# EAGLE design BOTTOM_BRD_v.1.0.3b (EAGLE 9.6.2)
NYU Shanghai Swarm Robotics 2020
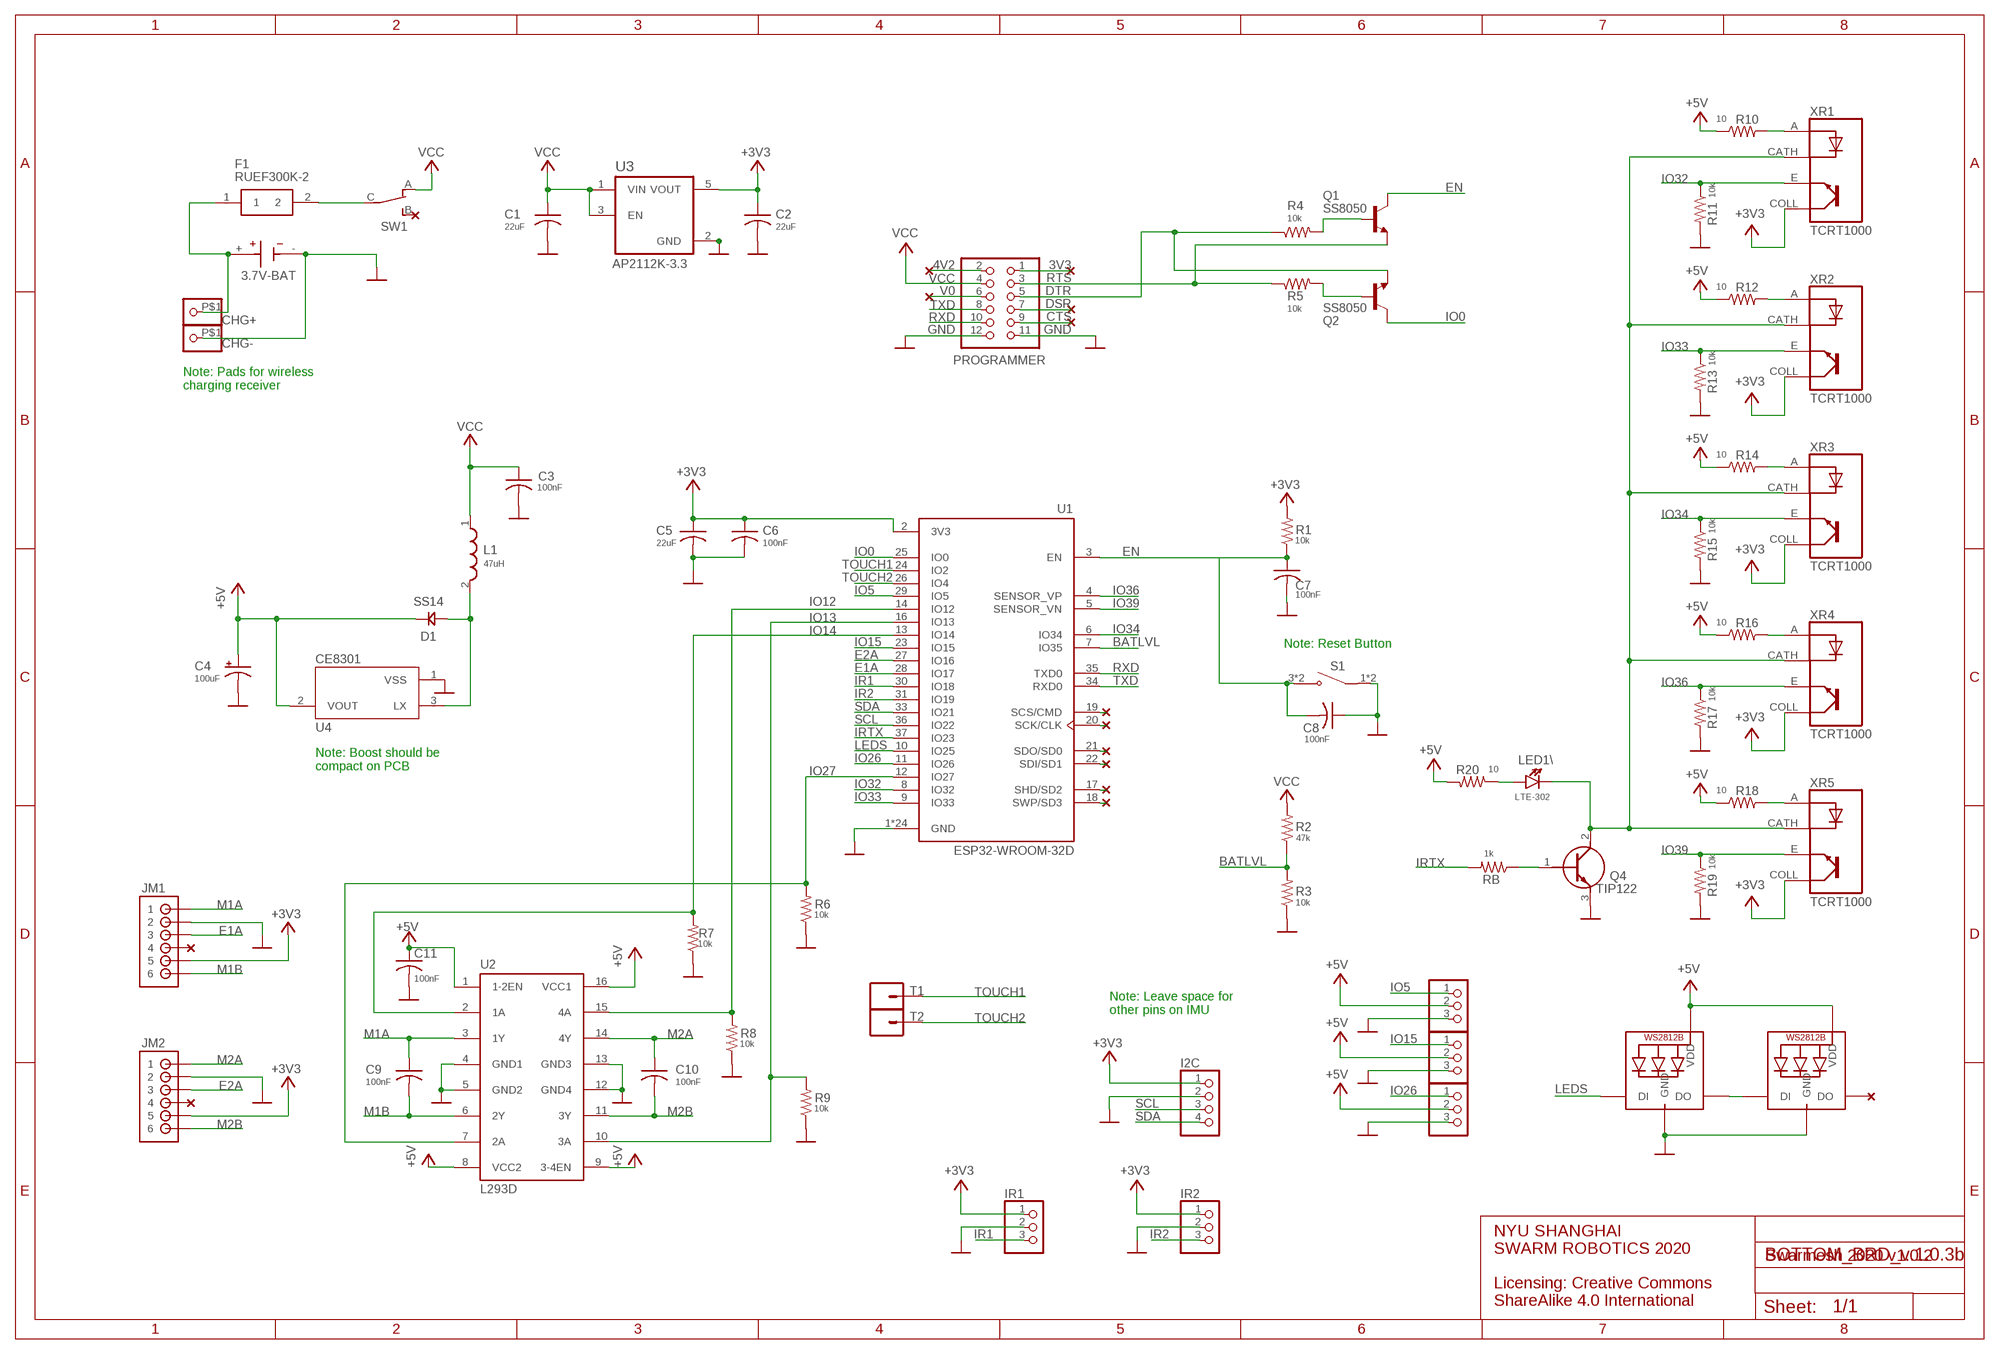
[diagram p0: schematic, sheet 1]

## Parts
BT  3.7V-BAT  6S-AA  [BAT_6S-AA]
C1  22uF  C-USC0805  [C0805]
C2  22uF  C-USC0805  [C0805]
C3  100nF  C-USC0805  [C0805]
C4  100uF  CPOL-US153CLV-0605  [153CLV-0605]
C5  22uF  C-USC0805  [C0805]
C6  100nF  C-USC0805  [C0805]
C7  100nF  C-USC0805  [C0805]
C8  100nF  C-USC0805  [C0805]
C9  100nF  C-USC0805  [C0805]
C10  100nF  C-USC0805  [C0805]
C11  100nF  C-USC0805  [C0805]
CHARGING  WS2812B5050  [WS2812B]
CHG+  PINHD-1X1-BIGPOGO  [1X1-BIGPOGO]
CHG-  PINHD-1X1-BIGPOGO  [1X1-BIGPOGO]
D1  SS14  [DO214]
F1  RUEF300K-2  [RUEF300K2]
GPIO5  PINHD-1X3  [1X03]
GPIO15  PINHD-1X3  [1X03]
GPIO26  PINHD-1X3  [1X03]
I2C  PINHD-1X4  [1X04]
IR1  PINHD-1X3  [1X03]
IR2  PINHD-1X3  [1X03]
JM1  B6B-ZR  [B6B-ZR]
JM2  B6B-ZR  [B6B-ZR]
L1  47uH  SDR0604-100KL  [INDP5858X480N]
LED1\  LTE-302  [LTE-302]
PROGRAMMER  PINHD-2X6  [2X06]
Q1  SS8050  BC850  [SOT23]
Q2  SS8050  BC850  [SOT23]
Q4  TIP122  [TO270P460X1020X2008-3P]
R1  10k  R-US_M0805  [M0805]
R2  47k  R-US_M0805  [M0805]
R3  10k  R-US_M0805  [M0805]
R4  10k  R-US_M0805  [M0805]
R5  10k  R-US_M0805  [M0805]
R6  10k  R-US_M0805  [M0805]
R7  10k  R-US_M0805  [M0805]
R8  10k  R-US_M0805  [M0805]
R9  10k  R-US_M0805  [M0805]
R10  10  R-US_M0805  [M0805]
R11  10k  R-US_M0805  [M0805]
R12  10  R-US_M0805  [M0805]
R13  10k  R-US_M0805  [M0805]
R14  10  R-US_M0805  [M0805]
R15  10k  R-US_M0805  [M0805]
R16  10  R-US_M0805  [M0805]
R17  10k  R-US_M0805  [M0805]
R18  10  R-US_M0805  [M0805]
R19  10k  R-US_M0805  [M0805]
R20  10  R-US_M0805  [M0805]
RB  1k  R-US_M0805  [M0805]
S1  2-1437565-9  [SW_2-1437565-9]
STATE  WS2812B5050  [WS2812B]
SW1  CS12ANW03  [CS12ANW03]
T1  CONN_01SPRING-CONN  [SPRING-CONNECTOR]
T2  CONN_01SPRING-CONN  [SPRING-CONNECTOR]
U1  ESP32-WROOM-32D  [MODULE_ESP32-WROOM-32D]
U2  L293D  [DIL16]
U3  AP2112K-3.3  AP2112K-3.3TRG1  [SOT95P285X140-5N]
U4  CE8301  MCP1702T-3302E/MB  [REG_MCP1702T-3302E/MB]
XR1  TCRT1000  [XDCR_TCRT1000]
XR2  TCRT1000  [XDCR_TCRT1000]
XR3  TCRT1000  [XDCR_TCRT1000]
XR4  TCRT1000  [XDCR_TCRT1000]
XR5  TCRT1000  [XDCR_TCRT1000]

## Nets
3V3: PROGRAMMER.1
4V2: PROGRAMMER.2
+3V3: C2.1 C5.1 C6.1 I2C.1 IR1.1 IR2.1 JM1.5 JM2.5 R1.2 U1.2(3V3) U3.5(VOUT) XR1.COLL(CO) XR2.COLL(CO) XR3.COLL(CO) XR4.COLL(CO) XR5.COLL(CO)
+5V: C4.+ C11.1 CHARGING.1-VDD(VDD) D1.CATHODE(KATHODE) GPIO5.2 GPIO15.2 GPIO26.2 R10.1 R12.1 R14.1 R16.1 R18.1 R20.2 STATE.1-VDD(VDD) U2.1(1-2EN) U2.8(VCC2) U2.9(3-4EN) U2.16(VCC1) U4.2(VOUT)
BATLVL: R2.1 R3.2 U1.7(IO35)
CTS: PROGRAMMER.9
DSR: PROGRAMMER.7
DTR: PROGRAMMER.5 Q2.2(E) R4.1
E1A: JM1.3 U1.28(IO17)
E2A: JM2.3 U1.27(IO16)
EN: C7.1 C8.2 Q1.3(C) R1.1 S1.3(NO) S1.4(NO) U1.3(EN)
GND: BT.- C1.2 C2.2 C3.2 C4.- C5.2 C6.2 C7.2 C8.1 C11.2 CHARGING.3-GND(GND) CHG-.P$1 GPIO5.3 GPIO15.3 GPIO26.3 I2C.2 IR1.2 IR2.2 JM1.2 JM2.2 PROGRAMMER.11 PROGRAMMER.12 Q4.3(E) R3.1 R6.1 R7.1 R8.1 R9.1 R11.2 R13.2 R15.2 R17.2 R19.2 S1.1(COM) S1.2(COM) STATE.3-GND(GND) U1.1(GND) U1.15(GND) U1.38(GND) U1.39_1(GND) U1.39_2(GND) U1.39_3(GND) U1.39_4(GND) U1.39_5(GND) U1.39_6(GND) U1.39_7(GND) U1.39_8(GND) U1.39_9(GND) U1.39_10(GND) U1.39_11(GND) U1.39_12(GND) U1.39_13(GND) U1.39_14(GND) U1.39_15(GND) U1.39_16(GND) U1.39_17(GND) U1.39_18(GND) U1.39_19(GND) U1.39_20(GND) U1.39_21(GND) U2.4(GND1) U2.5(GND2) U2.12(GND4) U2.13(GND3) U3.2(GND) U4.1(VSS)
IO0: Q2.3(C) U1.25(IO0)
IO5: GPIO5.1 U1.29(IO5)
IO12: R8.2 U1.14(IO12) U2.15(4A)
IO13: R9.2 U1.16(IO13) U2.10(3A)
IO14: R7.2 U1.13(IO14) U2.2(1A)
IO15: GPIO15.1 U1.23(IO15)
IO26: GPIO26.1 U1.11(IO26)
IO27: R6.2 U1.12(IO27) U2.7(2A)
IO32: R11.1 U1.8(IO32) XR1.E
IO33: R13.1 U1.9(IO33) XR2.E
IO34: R15.1 U1.6(IO34) XR3.E
IO36: R17.1 U1.4(SENSOR_VP) XR4.E
IO39: R19.1 U1.5(SENSOR_VN) XR5.E
IR1: IR1.3 U1.30(IO18)
IR2: IR2.3 U1.31(IO19)
IRTX: RB.2 U1.37(IO23)
LEDS: CHARGING.4-DIN(DI) U1.10(IO25)
M1A: C9.1 JM1.1 U2.3(1Y)
M1B: C9.2 JM1.6 U2.6(2Y)
M2A: C10.1 JM2.1 U2.14(4Y)
M2B: C10.2 JM2.6 U2.11(3Y)
N$1: BT.+ CHG+.P$1 F1.1
N$2: Q4.1(B) RB.1
N$3: F1.2 SW1.C
N$4: D1.ANODE L1.2 U4.3(LX)
N$5: U1.19(SCS/CMD)
N$6: R12.2 XR2.A
N$7: R16.2 XR4.A
N$8: LED1\.C Q4.2(C) XR1.CATH(C) XR2.CATH(C) XR3.CATH(C) XR4.CATH(C) XR5.CATH(C)
N$9: CHARGING.2-DOUT(DO) STATE.4-DIN(DI)
N$10: R14.2 XR3.A
N$11: R18.2 XR5.A
N$12: Q1.1(B) R4.2
N$13: R10.2 XR1.A
N$14: LED1\.A R20.1
N$15: Q2.1(B) R5.2
N$16: U1.20(SCK/CLK)
N$18: U1.21(SDO/SD0)
N$23: U1.22(SDI/SD1)
N$24: U1.17(SHD/SD2)
N$25: U1.18(SWP/SD3)
RTS: PROGRAMMER.3 Q1.2(E) R5.1
RXD: PROGRAMMER.10 U1.35(TXD0)
SCL: I2C.3 U1.36(IO22)
SDA: I2C.4 U1.33(IO21)
TOUCH1: T1.P$2 U1.24(IO2)
TOUCH2: T2.P$2 U1.26(IO4)
TXD: PROGRAMMER.8 U1.34(RXD0)
V0: PROGRAMMER.6
VCC: C1.1 C3.1 L1.1 PROGRAMMER.4 R2.2 SW1.A U3.1(VIN) U3.3(EN)
Unconnected: JM1.4 JM2.4 STATE.2-DOUT(DO) SW1.B

## Notes on the sheet
- Note: Pads for wireless 
  charging receiver
- Note: Reset Button
- Note: Boost should be
  compact on PCB
- Note: Leave space for 
  other pins on IMU
- Swarmesh 2020 v1.0.2
- NYU SHANGHAI
  SWARM ROBOTICS 2020
  
  Licensing: Creative Commons
  ShareAlike 4.0 International

## Library data of the parts
BT = 6S-AA:6S-AA; AVAILABILITY: Unavailable; DESCRIPTION: BATTERY HOLDER AA PC PIN; DIGIKEY-PURCHASE-URL: https://snapeda.com/shop?store=DigiKey&id=4389101; MF: MPD; MP: 6S-AA; PACKAGE: None; PRICE: None
C1-C3 C5-C11 = rcl:C-US: CAPACITOR, American symbol; SPICEPREFIX: C
C4 = rcl:CPOL-US: POLARIZED CAPACITOR, American symbol; SPICEPREFIX: C
CHARGING STATE = adafruit:WS2812B
CHG+ CHG- = adafruit:PINHD-1X1: Pin header 1x1 for 0.1" spacing With round pins
D1 = SS14:SS14; AVAILABILITY: Unavailable; DESCRIPTION: Diode Schottky 40V 1A Surface Mount SMA (DO-214AC); DIGIKEY-PURCHASE-URL: https://snapeda.com/shop?store=DigiKey&id=229686; MF: ON Semiconductor; MP: SS14; PACKAGE: DO-214AC-214 ON Semiconductor; PRICE: None
F1 = RUEF300K-2:RUEF300K-2: TE CONNECTIVITY / RAYCHEM - RUEF300K-2 - RESETTABLE FUSE, PTC, 30V, 3A, RADIAL Source: Datasheet <http://www.farnell.com/datasheets/1482689.pdf>; DESCRIPTION: TE CONNECTIVITY / RAYCHEM - RUEF300K-2 - RESETTABLE FUSE, PTC, 30V, 3A, RADIAL; HEIGHT: 16.5mm; MANUFACTURER_NAME: TE CONNECTIVITY / RAYCHEM; MANUFACTURER_PART_NUMBER: RUEF300K-2
GPIO5 GPIO15 GPIO26 IR1 IR2 = adafruit:PINHD-1X3: PIN HEADER
I2C = pinhead:PINHD-1X4: PIN HEADER
JM1 JM2 = B6B-ZR:B6B-ZR: JST-ZH Connector 6 pol, 1.5mm pitch Package: B6B-ZR Source: http://www.jst-mfg.com/product/pdf/eng/eZH.pdf; AVAILABILITY: Unavailable; DESCRIPTION: Connector Header Surface Mount 6 position 0.059 _1.50mm_; MF: JST; MP: B6B-ZR; PACKAGE: None; PRICE: None
L1 = SDR0604-100KL:SDR0604-100KL: Inductor Power Wirewound 120uH 10% 1KHz 22Q-Factor Ferrite 480mA 930mOhm DCR T/R; AVAILABILITY: Unavailable; DESCRIPTION: 10µH Unshielded Wirewound Inductor Nonstandard; MF: Bourns; MP: SDR0604-100KL; PACKAGE: Nonstandard Bourns; PRICE: None
LED1\ = LTE-302:LTE-302: Through-hole side-firing 940nm IR LED; DESCRIPTION: Infrared (IR) Emitter 940nm 1.2V 50mA 0.662mW/sr @ 20mA 40° Radial, Side View; DIGI-KEY_PART_NUMBER: 160-1930-ND; MF: Lite-On Inc.; MP: LTE-302; PACKAGE: Radial Lite-On
PROGRAMMER = pinhead:PINHD-2X6: PIN HEADER
Q1 Q2 = transistor:BC850: NPN TRANSISTOR
Q4 = TIP122:TIP122: TIP122, Darlington Transistor, NPN 8 A 100 V HFE:1000, 3-Pin, TO-220 Source: Datasheet <https://componentsearchengine.com/Datasheets/1/TIP122.pdf>; DESCRIPTION: TIP122, Darlington Transistor, NPN 8 A 100 V HFE:1000, 3-Pin, TO-220; HEIGHT: 4.6mm; MANUFACTURER_NAME: STMicroelectronics; MANUFACTURER_PART_NUMBER: TIP122; MOUSER_PART_NUMBER: 511-TIP122; MOUSER_PRICE-STOCK: https://www.mouser.com/Search/Refine.aspx?Keyword=511-TIP122
R1-R20 RB = rcl:R-US_: RESISTOR, American symbol; SPICEPREFIX: R
S1 = pushswitch:2-1437565-9; AVAILABILITY: Unavailable; COMMENT: 2-1437565-9; DESCRIPTION: Tactile Switch SPST-NO Top Actuated Surface Mount; MF: TE Connectivity; MP: 2-1437565-9; PACKAGE: SMD-6 Omron Electronics; PRICE: None
SW1 = SWITCH_C:CS12ANW03; AVAILABILITY: Unavailable; DESCRIPTION: Slide Switch SPDT Through Hole; DIGIKEY-PURCHASE-URL: https://snapeda.com/shop?store=DigiKey&id=478299; MF: NKK Switches; MP: CS12ANW03; PACKAGE: None; PRICE: None
T1 T2 = Touch_Pad:CONN_01: Single connection point. Often used as Generic Header-pin footprint for 0.1 inch spaced/style header connections On any of the 0.1 inch spaced packages, you can populate with these: Break Away Headers - Straight <https://www.sparkfun.com/products/116> (PRT-00116) Break Away Male Headers - Right Angle <https://www.sparkfun.com/products/553> (PRT-00553) Female Headers <https://www.sparkfun.com/products/115> (PRT-00115) Break Away Headers - Machine Pin <https://www.sparkfun.com/products/117> (PRT-00117) Break Away Female Headers - Swiss Machine Pin <https://www.sparkfun.com/products/743> (PRT-00743) This device is also useful as a general connection point to wire up your design to another part of your project. Our various solder wires solder well into these plated through hole pads. Hook-Up Wire - Assortment (Stranded, 22 AWG) <https://www.sparkfun.com/products/11375> (PRT-11375) Hook-Up Wire - Assortment (Solid Core, 22 AWG) <https://www.sparkfun.com/products/11367> (PRT-11367) View the entire wire category on our website here <https://www.sparkfun.com/categories/141> Special notes: SMTSO-256-ET is a "flush mount" nut for a 4-40 screw. We mostly use this on specialty testbeds; it is a nice way to connect hardware to your PCB at an adjustable hieght. Also note, the SNAP packages are for using a snappable style connector. We sell a baggie of snaps and they are also used on two LilyPad designs: Snap Assortment - 30 pack (male and female) <https://www.sparkfun.com/products/11347> (DEV-11347) LilyPad Arduino SimpleSnap <https://www.sparkfun.com/products/10941> (DEV-10941) LilyPad SimpleSnap Protoboard <https://www.sparkfun.com/products/10940> (DEV-10940); SF_ID: PRT-11822
U1 = ESP32-WROOM-32D:ESP32-WROOM-32D: Bluetooth, WiFi 802.11b/g/n, Bluetooth v4.2 + EDR, Class 1, 2 and 3 Transceiver Module 2.4GHz ~ 2.5GHz Integrated, Trace Surface Mount; AVAILABILITY: Unavailable; DESCRIPTION: Bluetooth, WiFi 802.11b/g/n, Bluetooth v4.2 +EDR, Class 1, 2 and 3 Transceiver Module 2.4GHz ~ 2.5GHz Integrated, Trace Surface Mount; MF: Espressif Systems; MP: ESP32-WROOM-32D; PACKAGE: Module Espressif Systems; PRICE: None
U2 = st-microelectronics:L293D: PUSH-PULL 4 CHANNEL DRIVER; MPN: L293D; OC_FARNELL: 9589619; OC_NEWARK: 56P8249
U3 = AP2112K-3.3TRG1:AP2112K-3.3TRG1: AP2112 Series 0.6 A 3.3 V Fixed Output SMT LDO Linear Regulator - SOT23-5; AVAILABILITY: Unavailable; DESCRIPTION: Linear Voltage Regulator IC 1 Output 600mA SOT-25; MF: Diodes Inc.; MP: AP2112K-3.3TRG1; PACKAGE: SOT-753 Diodes Inc.; PRICE: None
U4 = MCP1702T-3302E_MB:MCP1702T-3302E/MB: MCP1702 Series 250 mA 3.3 V Fixed Output Surface Mount LDO Regulator - SOT-89; AVAILABILITY: Unavailable; DESCRIPTION: Linear Voltage Regulator IC 1 Output 250mA SOT-89-3; MF: Microchip; MP: MCP1702T-3302E/MB; PACKAGE: SOT-89 Microchip; PRICE: None
XR1-XR5 = ST188:TCRT1000: Optical Sensor The TCRT1000 and TCRT1010 are reflective sensors which include an infrared emitter and phototransistor in a leaded package which blocks visible light; AVAILABILITY: Unavailable; DESCRIPTION: Reflective Optical Sensor 0.157 (4mm) PCB Mount; MF: Vishay; MP: TCRT1000; PACKAGE: PCB Mount Vishay; PRICE: None

## Board
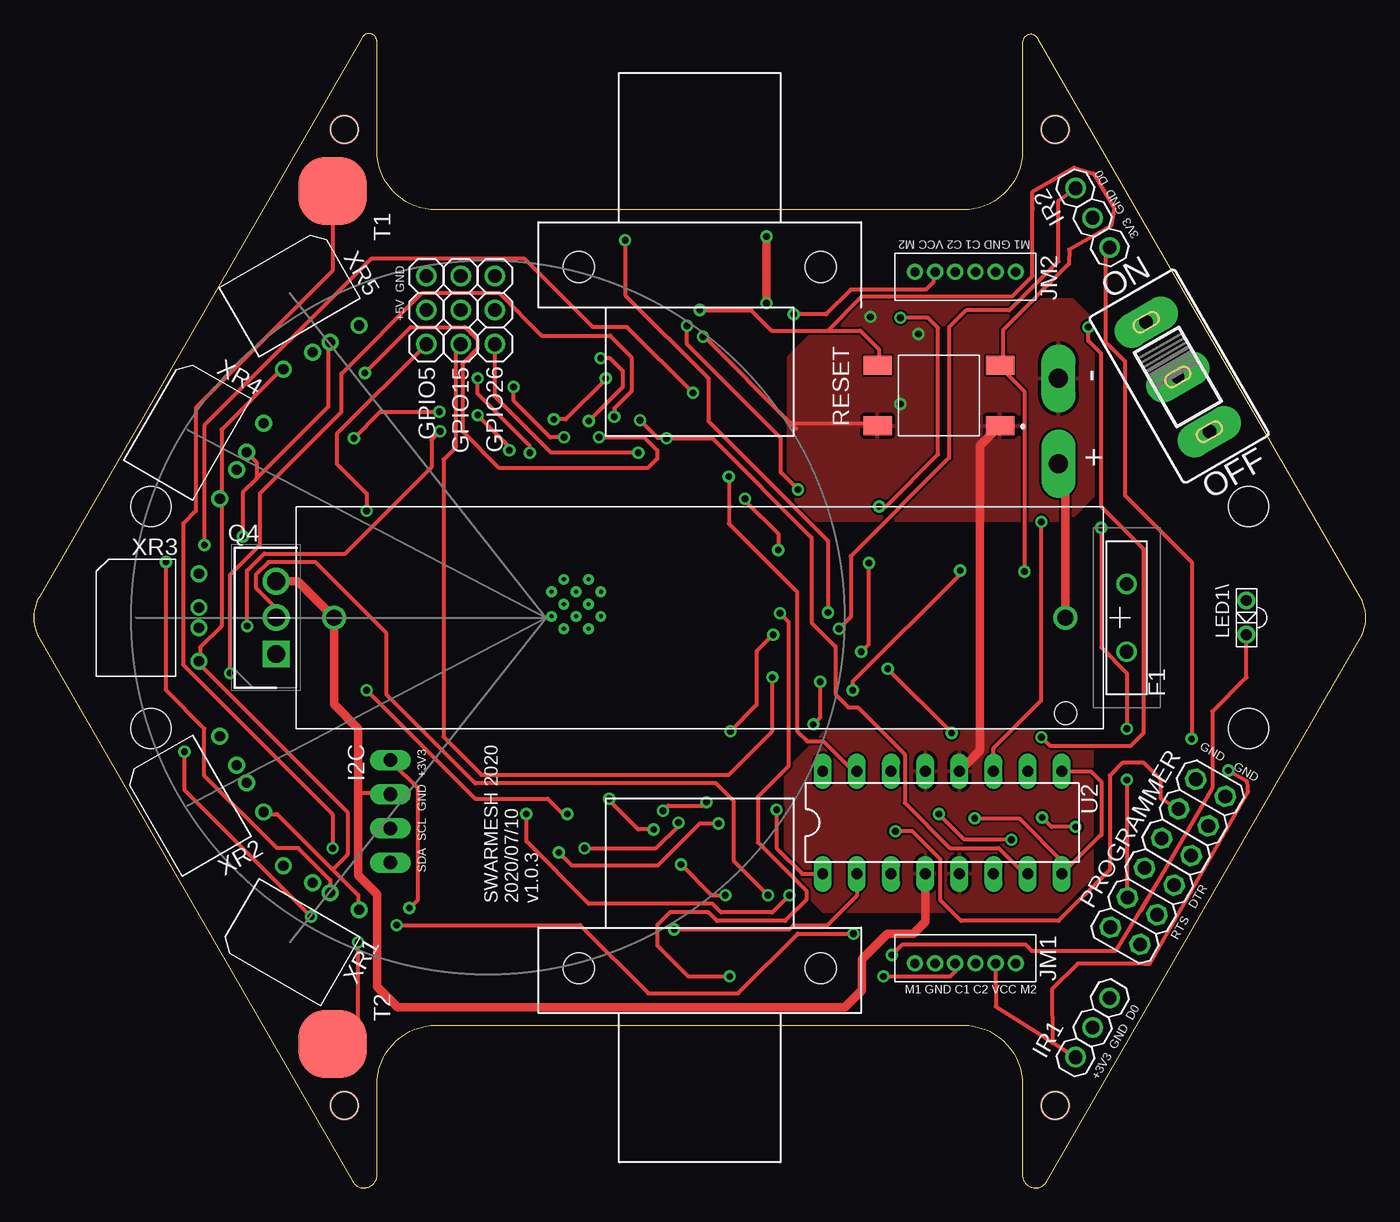
[diagram p1: board, top side]
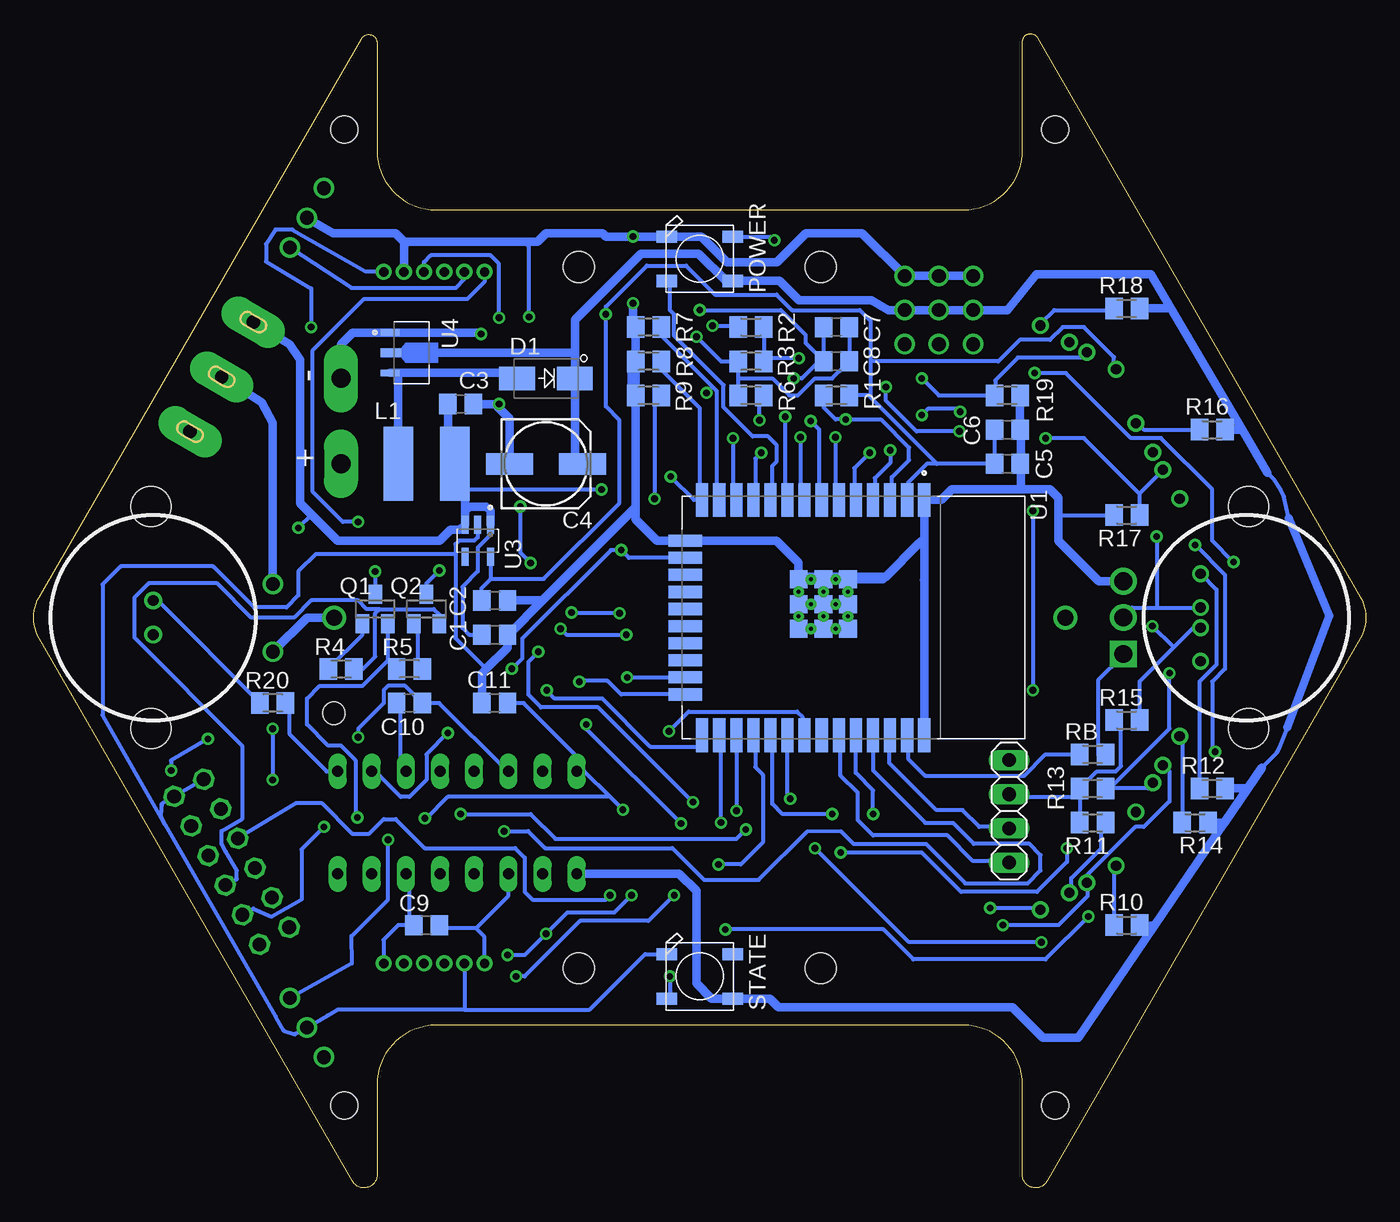
[diagram p2: board, bottom side, seen from below]

Size 99.06 x 85.8 mm. Coordinates in mm from the lower left corner, seen from the top.
Outline: 75.33,0.48 98.65,40.87 arc60 98.65,43.91 74.68,85.43 arc150 73.53,85.12 73.53,77.1 arc-90 69.12,72.69 29.94,72.69 arc-90 25.53,77.1 25.53,85.2 arc150 24.42,85.5 0.41,43.91 arc60 0.41,40.87 23.73,0.48 arc150 25.53,0.97 25.53,7.68 arc-90 29.94,12.09 69.12,12.09 arc-90 73.53,7.68 73.53,0.97 arc150 75.33,0.48
Copper layers (1*16): Top 0.035mm / dielectric 0.15mm / Bottom 0.035mm
Design rules "default *": minimum track width 12mil, minimum drill 0.5mm, track to track 6mil, track to pad 6mil, pad to pad 6mil, via to via 20mil, smd to smd 6mil, copper to edge 40mil, drill to drill 25mil, minimum pad ring 10mil, minimum via ring 8mil, stop-mask expansion 4mil, vias tented up to drill 0mil, thermal gap 10mil
Holes 2 mm at 75.96,78.66 23.11,78.66 23.11,6.12 75.96,6.12
Holes 3 mm at 8.73,50.64 8.73,34.14 90.33,50.64 90.33,34.14
Holes 2.3 mm at 58.53,16.33 40.53,16.33 40.53,68.45 58.53,68.45
tKeepout: area 74.3,77 to 77.6,80.3; area 21.5,77 to 24.7,80.3; area 21.5,4.5 to 24.7,7.7; area 74.3,4.5 to 77.6,7.7
tRestrict: area 30.8,33.4 to 49.8,51.3

### Footprints (pad centres in the part's own frame; a part is rotated, then mirrored left to right if it is on the bottom)
BAT_6S-AA = drill 1.19: + -27.2,0; - 27.2,0 | hole 1.67: -27.2,7.1
C0805 = smd 1.3 x 1.5: 1 -0.95,0; 2 0.95,0
153CLV-0605 = smd 3.5 x 1.6: + 2.7,0; - -2.7,0
WS2812B = smd 1.5 x 0.9: 1-VDD 2.45,-1.65; 2-DOUT 2.45,1.65; 3-GND -2.45,1.65; 4-DIN -2.45,-1.65
1X1-BIGPOGO = drill 1.4 pad 2.54 long: P$1 0,0
DO214 = smd 2.65 x 1.75: ANODE -2.15,0; CATHODE 2.15,0
RUEF300K2 = drill 1.01 pad 1.515: 1 0,0; 2 5.05,0
1X03 = drill 1.016: 1 -2.54,0; 2 0,0; 3 2.54,0
1X04 = drill 1.016 long: 1 -3.81,0; 2 -1.27,0; 3 1.27,0; 4 3.81,0
B6B-ZR = drill 0.7: 1 9,-1.3; 2 7.5,-1.3; 3 6,-1.3; 4 4.5,-1.3; 5 3,-1.3; 6 1.5,-1.3
INDP5858X480N = smd 2.2 x 5.5: 1 -2.1,0; 2 2.1,0
LTE-302 = drill 0.8: A 1.27,0; C -1.27,0
2X06 = drill 1.016 octagon: 1 -6.35,-1.27; 2 -6.35,1.27; 3 -3.81,-1.27; 4 -3.81,1.27; 5 -1.27,-1.27; 6 -1.27,1.27; 7 1.27,-1.27; 8 1.27,1.27; 9 3.81,-1.27; 10 3.81,1.27; 11 6.35,-1.27; 12 6.35,1.27
SOT23 = smd 1 x 1.4: 1 -0.95,-1.1; 2 0.95,-1.1; 3 0,1.1
TO270P460X1020X2008-3P = drill 1.32 pad 1.98 square: 1 0,0 | drill 1.32 pad 1.98: 2 2.7,0; 3 5.4,0
M0805 = smd 1.3 x 1.6: 1 -0.95,0; 2 0.95,0
SW_2-1437565-9 = smd 2.1 x 1.4: 1 -4.55,2.25; 2 4.55,2.25; 3 -4.55,-2.25; 4 4.55,-2.25
CS12ANW03 = drill 1 pad 2.54 long: A -4.674,0; B 4.724,0; C 0.025,0
SPRING-CONNECTOR = smd 5.08 x 5.08: P$2 0,0
MODULE_ESP32-WROOM-32D = smd 2.5 x 0.9: 1 -8.75,5.26; 2 -8.75,3.99; 3 -8.75,2.72; 4 -8.75,1.45; 5 -8.75,0.18; 6 -8.75,-1.09; 7 -8.75,-2.36; 8 -8.75,-3.63; 9 -8.75,-4.9; 10 -8.75,-6.17; 11 -8.75,-7.44; 12 -8.75,-8.71; 13 -8.75,-9.98; 14 -8.75,-11.25; 25 8.75,-11.25; 26 8.75,-9.98; 27 8.75,-8.71; 28 8.75,-7.44; 29 8.75,-6.17; 30 8.75,-4.9; 31 8.75,-3.63; 32 8.75,-2.36; 33 8.75,-1.09; 34 8.75,0.18; 35 8.75,1.45; 36 8.75,2.72; 37 8.75,3.99; 38 8.75,5.26 | smd 0.9 x 2.5: 15 -5.715,-12.5; 16 -4.445,-12.5; 17 -3.175,-12.5; 18 -1.905,-12.5; 19 -0.635,-12.5; 20 0.635,-12.5; 21 1.905,-12.5; 22 3.175,-12.5; 23 4.445,-12.5; 24 5.715,-12.5 | smd 1.33 x 1.33: 39_1 -2.835,-0.405; 39_2 -1,-0.405; 39_3 0.835,-0.405; 39_4 -2.835,-2.24; 39_5 -1,-2.24; 39_6 0.835,-2.24; 39_7 -2.835,-4.075; 39_8 -1,-4.075; 39_9 0.835,-4.075 | drill 0.3 pad 0.4: 39_10 -1.917,-0.405; 39_11 -0.083,-0.405; 39_12 -2.835,-1.323; 39_13 -1,-1.323; 39_14 0.835,-1.323; 39_15 -1.917,-2.24; 39_16 -0.083,-2.24; 39_17 -2.835,-3.158; 39_18 -1,-3.158; 39_19 0.835,-3.158; 39_20 -1.917,-4.075; 39_21 -0.083,-4.075
DIL16 = drill 0.813 long: 1 -8.89,-3.81; 2 -6.35,-3.81; 3 -3.81,-3.81; 4 -1.27,-3.81; 5 1.27,-3.81; 6 3.81,-3.81; 7 6.35,-3.81; 8 8.89,-3.81; 9 8.89,3.81; 10 6.35,3.81; 11 3.81,3.81; 12 1.27,3.81; 13 -1.27,3.81; 14 -3.81,3.81; 15 -6.35,3.81; 16 -8.89,3.81
SOT95P285X140-5N = smd 1.35 x 0.6: 1 -1.185,0.95; 2 -1.185,0; 3 -1.185,-0.95; 4 1.185,-0.95; 5 1.185,0.95
REG_MCP1702T-3302E/MB = smd 1.4 x 0.48: 1 -1.425,1.5; 3 -1.425,-1.5 | smd 1.525 x 0.56: 2 -1.365,0
XDCR_TCRT1000 = drill 0.75 pad 1.1: A -3.25,4.67; CATH -0.75,4.67; COLL 3.25,4.67; E 0.75,4.67

### Placement (x,y rotation side)
BT  49.53,42.39 180 top
C1  64.77,41.12 0 bottom
C2  64.77,43.66 0 bottom
C3  67.31,58.27 0 bottom
C4  60.96,53.82 0 bottom
C5  26.67,53.82 0 bottom
C6  26.67,56.36 0 bottom
C7  39.37,63.98 0 bottom
C8  39.37,61.44 180 bottom
C9  69.85,19.53 180 bottom
C10  71.12,36.04 180 bottom
C11  64.77,36.04 180 bottom
CHARGING  49.53,69.06 0 bottom
CHG+  76.2,53.82 270 bottom
CHG-  76.2,60.17 90 top
D1  60.96,60.17 0 bottom
F1  81.28,39.85 90 top
GPIO5  29.21,65.25 90 top
GPIO15  31.75,65.25 90 top
GPIO26  34.29,65.25 90 top
I2C  26.53,27.99 270 bottom
IR1  78.74,11.91 60 top
IR2  78.74,72.11 120 top
JM1  74.53,15.39 180 top
JM2  64.03,69.39 0 top
L1  69.85,53.82 180 bottom
LED1\  90.17,42.39 90 top
PROGRAMMER  84.34,24.24 60 top
Q1  73.66,43.03 0 bottom
Q2  69.85,43.03 0 bottom
Q4  18.03,39.69 90 top
R1  39.37,58.9 0 bottom
R2  45.72,63.98 180 bottom
R3  45.72,61.44 0 bottom
R4  76.2,38.58 180 bottom
R5  71.12,38.58 0 bottom
R6  45.72,58.9 0 bottom
R7  53.34,63.98 0 bottom
R8  53.34,61.44 0 bottom
R9  53.34,58.9 0 bottom
R10  17.78,19.53 180 bottom
R11  20.32,27.15 180 bottom
R12  12.7,27.15 180 bottom
R13  20.32,29.69 180 bottom
R14  11.43,29.69 180 bottom
R15  17.78,34.77 180 bottom
R16  11.43,56.36 180 bottom
R17  17.78,50.01 180 bottom
R18  17.78,65.38 180 bottom
R19  26.67,58.9 0 bottom
R20  81.28,36.04 0 bottom
RB  20.32,32.23 180 bottom
S1  67.31,58.9 180 top
STATE  49.53,15.72 0 bottom
SW1  85.06,60.3 300 top
T1  22.23,74.09 0 top
T2  22.23,10.69 0 top
U1  38.1,42.39 270 bottom
U2  67.56,27.15 0 top
U3  66.04,48.11 270 bottom
U4  71.12,62.08 0 bottom
XR1  19.05,18.26 330 top
XR2  11.43,28.42 300 top
XR3  7.62,42.39 270 top
XR4  11.43,56.36 240 top
XR5  19.05,66.52 210 top

### Tracks (layer width: path | path; a pad name or v marks a point on that pad's centre or on a via)
+3V3  (via drill 0.5)
  Top 0.305: 22.22,23.66 18.1,27.79 17.14,27.79 XR2.COLL | 22.22,23.66 24.13,21.75 24.13,20.8 XR1.COLL | v27.94,20.8 28.57,21.44 28.57,29.69 26.67,31.6 I2C.1 | XR5.COLL 18.41,60.81 13.97,56.36 13.97,51.28 XR4.COLL 13.97,50.96 13.97,41.76 12.38,40.17 12.38,39.22 XR3.COLL 12.38,38.9 23.34,27.94 23.34,24.78 22.22,23.66 | v86.11,33.37 86.11,46.52 81.15,51.47 81.15,61.44 79.69,62.9 79.69,69.63 79.97,69.91 IR2.1 | v56.51,64.93 58.93,64.93 60.77,66.78 66.36,66.78 66.94,67.36 JM2.5 | v88.84,31.02 90.21,30.22 90.3,29.41 82.98,16.67 82.55,16.67 77.63,16.67 75.77,14.81 75.78,10.78 | 75.78,10.78 73.34,12.33 71.54,13.48 JM1.5 | 75.78,10.78 IR1.1
  Bottom 0.305: U1.2 34.04,51.22 34.04,52.42 32.64,53.82 31.9,53.82 | 36.83,61.44 36.83,64.44 37.62,65.24 42.66,65.24 43.81,66.39 48.39,66.39 50.55,68.55 53.47,68.55 56.51,65.51 v56.51,64.93 56.51,58.09 55.5,57.07 55.5,50.9 61.13,45.27 65.09,45.27 U3.5 65.09,45.25 65.79,44.55 65.79,43.73 C2.1 | 36.83,61.44 36.83,58.9 36.98,58.9 | 27.63,56.38 C6.1 C5.1 31.9,53.82 | v27.94,20.8 24.45,20.8 XR1.COLL | 36.98,58.9 R1.2 | 36.83,61.44 27.33,61.44 25.74,63.03 23.49,63.03 22.54,63.98 20.95,63.98 18.73,61.76 18.73,61.12 XR5.COLL | JM2.5 67.03,67.58 67.67,66.9 75.43,66.9 IR2.1 | 31.9,53.82 36.98,58.9 | v86.11,33.37 88.85,31.77 v88.84,31.02
+5V  (via drill 0.5)
  Top 0.305: 76.83,23.66 76.96,23.79 76.45,24.29 | U2.9 78.61,30.96 79.37,30.2 79.37,26.2 79.31,26.2 U2.8 76.45,24.29 | v55.24,28.1 55.24,25.25 57.15,23.34 U2.1 | 76.45,24.29 73.28,27.47 v69.98,27.47
  Bottom 0.305: 5.83,34.23 6.43,32.74 6.63,32.36 7.75,31.24 | 5.71,49.76 6.1,51.41 6.35,51.92 6.86,52.68 7.32,53.17 | R20.2 80.02,36.04 80.02,33.7 77.28,30.96 U2.9 | C11.1 62.62,36.04 58.67,32.09 U2.16 58.62,31.01 58.15,31.01 56.2,29.06 | 56.2,29.06 v55.24,28.1 | v69.98,27.47 69.85,27.47 68.26,29.06 56.2,29.06
  Bottom 0.635: U2.1 51.05,23.34 49.78,22.07 49.78,15.21 48.64,14.07 STATE.1-VDD 44.32,14.07 43.69,13.44 26.29,13.44 24,11.15 21.37,11.15 15.73,19.48 | 7.75,31.24 8.79,29.71 | 8.79,29.71 10.53,27.14 | 10.53,27.14 15.73,19.48 | C4.+ 58.26,53.57 58.81,54.12 D1.CATHODE 58.81,62.08 | U4.2 58.81,62.08 | 58.81,62.08 58.81,64.51 53.88,69.44 49.62,69.44 47.59,67.41 CHARGING.1-VDD 43.6,67.41 42.15,65.96 36.76,65.96 35.48,65.25 GPIO26.2 GPIO15.2 GPIO5.2 26.67,65.25 24.49,67.92 15.97,67.92 14.49,65.39 | 5.83,34.23 2.71,42.53 5.71,49.76 | 7.32,53.17 9.18,56.34 | 9.18,56.34 14.49,65.39 | R14.1 8.79,29.71 | R12.1 10.53,27.14 | R10.1 15.73,19.48 | R16.1 9.18,56.34 | R18.1 14.49,65.39
BATLVL  (via drill 0.5)
  Top 0.305: v42.16,61.66 42.86,61.66 43.81,60.71 43.81,59.54 v41.27,57
  Bottom 0.305: 44.77,61.76 R2.1 | 44.77,61.76 44.77,61.66 | 44.77,61.66 R3.2 44.77,61.76 | v42.16,61.66 44.77,61.66 | v41.27,57 40.64,56.36 40.64,51.28 U1.7
DTR
  Bottom 0.305: Q2.2 68.9,42.62 69.3,43.03 73.34,43.03 | 73.34,43.03 73.66,42.71 73.66,39.48 74.56,38.58 R4.1 | 73.34,43.03 74.29,43.03 74.93,43.66 78.42,43.66 79.69,42.39 82.87,42.39 85.41,44.93 90.49,44.93 91.57,43.85 91.57,40.93 83.57,32.87 83.57,27.41 85.09,26.52 85.09,25.56 84.77,24.99 83.95,23.6 83.95,22.96 PROGRAMMER.5
E1A  (via drill 0.5)
  Top 0.305: JM1.3 68.54,16.68 68.54,16.1 68.16,15.72 v63.18,15.72 | v51.43,21.75 50.42,21.75 v48.13,24.04
  Bottom 0.305: v63.18,15.72 62.55,15.72 58.42,19.85 53.34,19.85 v51.43,21.75 | v48.13,24.04 46.48,24.04 44.83,25.69 44.83,30.71 45.4,31.28 45.4,33.5 U1.28
E2A  (via drill 0.5)
  Top 0.305: v64.45,64.68 66.48,64.68 67.25,63.92 67.25,54.52 63.37,50.65 v62.86,50.65 | v62.1,46.46 62.1,40.42 v61.53,39.85 | v50.04,28.68 49.78,28.42 47.18,28.42 v46.8,28.04
  Bottom 0.305: JM2.3 70.03,68.82 69.53,69.32 65.09,69.32 64.45,68.68 v64.45,64.68 | v62.86,50.65 62.86,47.22 v62.1,46.46 | v61.53,39.85 62.29,39.09 62.29,36.68 61.34,35.72 57.09,35.72 v50.04,28.68 | v46.8,28.04 46.8,33.63 U1.27
EN  (via drill 0.5)
  Top 0.305: v73.66,45.82 73.66,59.22 71.75,61.12 S1.3 72.07,61.44 72.07,63.76 76.98,68.67 77,69.76 80.08,71.51 80.35,72.82 78.85,75.4 77.36,75.84 74.28,74.04 74.28,72.69 | 59.05,63.73 54.86,63.73 53.34,65.25 v49.53,65.25 | 59.05,63.73 61.47,63.73 62.86,62.33 62.86,61.26 S1.4 | v42.54,60.17 42.54,60.11 39.56,57.12 v38.67,57.12 | 74.28,72.69 74.28,67.77 72.77,66.27 61.59,66.27 59.05,63.73 | 74.28,72.85 74.28,72.69
  Bottom 0.305: v73.66,45.82 Q1.3 | R1.1 40.3,58.9 40.3,58 39.43,57.12 v38.67,57.12 36.07,57.12 33.97,55.03 33.97,54.1 35.24,52.83 35.24,51.28 U1.3 | 40.32,62.08 C7.1 | 40.32,62.08 C8.2 | v49.53,65.25 43.5,65.25 41.63,63.39 41.63,62.8 40.32,61.48 C8.2 | 40.32,62.08 C8.2 | C8.2 40.67,61.44 41.94,60.17 v42.54,60.17
GND  (via drill 0.5)
  Top 0.305: 24.13,29.37 26.35,29.37 I2C.2 | 56.7,56.43 56.28,56.85 | 56.28,56.85 49.86,63.26 v49.76,63.26 | 76.35,60.32 76.28,60.22 CHG-.P$1 76.45,60.43 76.35,60.43 | 56.28,56.85 62.57,56.85 S1.2
  Top 0.635: Q4.3 19.63,45.09 BT.- 22.33,35.94 24.13,34.14 24.13,29.37 24.13,23.25 25.54,21.84 25.54,14.94 27.06,13.42 60.32,13.42 61.59,14.69 61.59,16.99 63.5,18.9 65.4,18.9 66.29,19.79 U2.4 | U2.12 70.36,32.49 70.36,55.15 S1.1 | v54.48,65.76 v54.48,70.71
  Bottom 0.305: PROGRAMMER.12 88.45,29.19 | 88.45,29.19 PROGRAMMER.11 | 67.06,13.26 57.71,13.26 53.59,17.37 STATE.3-GND | JM1.2 67.03,13.28 67.06,13.26 | 67.06,13.26 76.45,13.26 77.22,12.8 IR1.2 79.63,11.41 80.46,11.69 81.05,12.73 | 81.05,12.73 89.26,26.98 | 89.26,26.98 89.58,27.53 89.54,28.22 89.53,28.42 89.53,28.55 88.45,29.19 | 81.05,12.73 | 67.69,47.09 78.1,47.09 79.37,45.82 79.37,44.04 80.26,43.15 82.68,43.15 85.72,46.2 92.58,46.2 93.93,44.86 93.93,35.14 89.26,26.98 | U3.2 66.04,48.36 66.29,48.11 67.44,48.11 67.69,47.85 67.69,47.09 | 67.69,47.09 67.69,40.87 65.4,38.58 | U1.39_17 40.96,45.25 40.64,45.25 U1.39_4 40.32,44.93 40.32,44.61 U1.39_15 40.32,44.3 40.32,43.66 U1.39_5 40.64,43.66 40.96,43.66 U1.39_18 41.27,43.34 41.91,43.34 U1.39_8 | U1.39_9 42.23,41.76 42.23,42.39 U1.39_21 42.23,42.71 42.23,43.34 U1.39_8 | U1.39_8 42.23,43.66 42.23,44.3 U1.39_20 42.23,44.61 42.23,44.93 U1.39_7 41.91,45.57 35.88,45.57 35.72,45.41 | 54.48,64.11 R7.1 | C7.2 C8.1 38.73,61.44 38.73,61.12 39.69,60.17 40.96,60.17 42.23,58.9 42.86,58.9 44.13,60.17 46.67,60.17 | R3.1 46.67,60.17 | 46.67,60.17 R6.1 | R13.2 20,30.96 18.61,30.96 18.21,31.36 18.21,34.77 R15.2 | R13.2 21.27,29.06 | 21.27,29.06 R11.2 | R13.2 21.27,29.06 | 38.73,41.76 38.73,42.39 U1.39_11 38.73,42.71 38.73,43.34 | 38.73,41.76 39.37,41.76 U1.39_14 39.69,41.76 40.32,41.76 | 38.73,41.76 U1.39_3 | U1.39_19 40.96,41.76 40.64,41.76 U1.39_6 40.32,41.76 | 40.32,41.76 40.32,42.39 U1.39_16 | 38.73,43.34 39.37,43.34 U1.39_13 | C5.2 25.65,53.82 | 22.86,50.01 R17.2 | U1.39_12 39.37,45.25 38.73,45.25 U1.39_1 38.73,44.93 38.73,44.61 U1.39_10 38.73,44.3 38.73,43.66 U1.39_2 38.73,43.34
  Bottom 0.305: C6.2 25.65,56.36 | 33.02,45.19 33.02,47.79 33.18,47.95 | 33.02,33.82 U1.38 | v64.45,58.27 64.61,58.11 | 21.27,29.06 26.35,29.06 I2C.2 | R3.1 47.94,61.44 v49.76,63.26 | R3.1 | v62.23,64.74 62.23,70.05 | 62.23,70.05 62.23,70.33 | GPIO15.3 31.7,67.77 31.7,67.79 | 62.23,70.05 62.33,70.05 62.33,70.33
  Bottom 0.635: 25.65,51.92 23.49,51.92 22.86,51.28 22.86,50.01 22.86,48.11 19.84,45.09 Q4.3 | JM2.2 71.53,70.11 71.3,70.33 | 71.3,70.33 71.5,70.33 72.14,70.97 76.79,70.97 78.74,72.06 IR2.2 | 71.3,70.33 62.33,70.33 61.59,70.33 60.96,70.97 56.77,70.97 56.52,70.71 | CHARGING.3-GND v54.48,70.71 56.52,70.71 | 55.88,70.71 56.51,70.71 56.52,70.71 | CHARGING.3-GND 52.07,70.62 | 54.61,61.44 R8.1 54.61,61.12 54.61,58.9 R9.1 | R9.1 54.29,50.58 | 54.29,50.58 54.29,49.69 52.7,48.11 U1.15 43.81,48.11 42.17,46.47 U1.39_7 | U1.39_1 35.9,45.23 35.72,45.41 33.18,47.95 32.84,48.29 | 32.84,48.29 U1.1 31.57,51.14 30.79,51.92 25.65,51.92 | 25.65,56.36 25.65,53.82 25.65,51.92 | GPIO5.3 31.7,67.79 GPIO15.3 GPIO26.3 37.46,70.97 41.61,70.97 43.77,68.81 47.5,68.81 49.4,70.71 CHARGING.3-GND | R9.1 R7.1 | v54.48,65.76 54.48,64.11 | CHG-.P$1 76.2,62.71 75.33,63.58 U4.1 65.89,63.58 v65.79,63.47 | C4.- 63.66,57.16 64.61,58.11 64.77,58.27 C3.2 | 61.21,43.66 63.75,41.12 C1.2 63.82,40.17 65.4,38.58 65.72,38.27 C11.2 | 61.21,43.66 54.29,50.58 | C6.2 R19.2 | C2.2 61.21,43.66 | 32.84,48.29 U1.38
  pour Top: 60.44,66.01 77.22,66.01 78.74,64.49 78.74,51.41 76.96,49.63 57.28,49.63 56.17,50.74 56.17,61.75
  pour Top: 77.37,34.11 78.74,32.74 78.74,23.09 76.14,20.49 58.73,20.49 55.88,23.34 55.88,30.96 59.03,34.11
IO0  (via drill 0.5)
  Top 0.305: v68.9,45.88 68.9,45.63 60.9,37.63 v60.9,36.99
  Bottom 0.305: Q2.3 69.85,44.93 v68.9,45.88 | v60.9,36.99 60.96,36.99 60.32,36.36 56.77,36.36 53.21,32.8 49.55,32.8 49.35,33.01 U1.25
IO5  (via drill 0.5)
  Top 0.305: v39.69,27.79 39.37,27.79 38.23,28.93 32.83,28.93 v24.76,36.99 | v24.76,50.33 24.76,51.6 22.54,53.82 22.54,56.04 GPIO5.1
  Bottom 0.305: v39.69,27.79 43.37,27.79 44.13,28.55 44.13,33.5 U1.29 | v24.76,50.33 v24.76,36.99
IO12  (via drill 0.5)
  Top 0.305: v51.69,52.87 51.69,49.38 56.77,44.3 56.77,33.95 57.53,33.18 58.74,33.18 60.96,30.96 U2.15
  Bottom 0.305: R8.2 52.39,60.81 49.53,57.95 49.53,51.28 U1.14 49.96,51.14 v51.69,52.87
IO13  (via drill 0.5)
  Top 0.305: v63.5,38.58 v68.26,33.82 | v52.89,51.22 52.89,51.09 55.37,48.61 v55.37,47.41
  Bottom 0.305: R9.2 52.89,58.4 v52.89,51.22 | v68.26,33.82 69.85,32.23 69.85,30.33 71.12,29.06 71.75,29.06 73.66,30.96 U2.10 | U1.16 54.8,46.84 v55.37,47.41 56.13,47.41 62.74,40.8 62.74,39.34 v63.5,38.58
IO14  (via drill 0.5)
  Top 0.305: U2.2 61.21,21.72 59.03,19.53 56.51,19.53 56.2,19.21 v47.62,19.21 | v20.64,20.17 11.21,29.59 v11.21,32.41 | v12.7,47.79 12.7,56.68 25.08,69.06 36.51,69.06 41.59,63.98 44.13,63.98 v49.02,59.09
  Bottom 0.305: 48.58,59.54 48.26,59.22 48.26,51.28 U1.13 | 48.58,59.54 52.39,63.35 R7.2 | v47.62,19.21 35.88,19.21 33.65,16.99 23.81,16.99 v20.64,20.17 | v11.21,32.41 11.21,32.47 11.43,32.68 11.43,37.63 10.48,38.58 10.48,45.57 v12.7,47.79 | 48.58,59.54 v49.02,59.09
IO15  (via drill 0.5)
  Top 0.305: v54.93,37.95 54.93,33.95 51.69,30.71 33.31,30.71 30.48,33.53 30.48,54.14 31.37,55.03 31.37,62.33 GPIO15.1
  Bottom 0.305: v54.93,37.95 U1.23
IO26  (via drill 0.5)
  Top 0.305: GPIO26.1 34.29,58.84 38.48,54.65 v44.96,54.65
  Bottom 0.305: v44.96,54.65 45.4,54.2 45.4,51.28 U1.11
IO27  (via drill 0.5)
  Top 0.305: v45.08,57.06 46.42,55.73 v47.05,55.73 50.46,55.73 57.85,48.34 57.85,42.01 59.63,40.23 59.63,36.68 60.58,35.72 61.28,35.72 64.77,32.23 64.77,28.61 68.13,25.25 71.75,25.25 73.66,23.34 U2.7
  Bottom 0.305: v45.08,57.06 45.08,58.9 R6.2 | v47.05,55.73 47.05,51.38 U1.12
IO32  (via drill 0.5)
  Top 0.305: v42.04,55.79 45.4,55.79 46.35,54.84 46.35,54.19 45.66,53.5 34.61,53.5 31.88,56.23 31.88,61.25 33.02,62.39 33.02,63.03 32.07,63.98 28.04,63.98 v24.62,60.57 | v9.84,46.52 9.84,36.99 12.7,34.14 12.7,30.64 18.1,25.25 19.68,25.25 22.06,22.87 22.06,21.96 XR1.E
  Bottom 0.305: R11.1 19.68,27.15 19.68,25.25 21.91,23.02 21.91,22.07 XR1.E | v42.04,55.79 42.04,51.38 U1.8 | v24.62,60.57 22.3,60.57 17.46,55.73 15.24,55.73 11.43,51.92 11.43,48.11 v9.84,46.52
IO33  (via drill 0.5)
  Top 0.305: v43.18,57.31 43.18,57.95 44.45,59.22 44.45,61.76 42.86,63.35 37.78,63.35 34.61,66.52 28.89,66.52 22.89,60.52 22.89,57.68 16.83,51.62 16.83,47.79 14.6,45.57 v14.6,38.26
  Bottom 0.305: 19.05,29.69 16.19,29.69 15.87,30.01 XR2.E | v43.18,57.31 43.18,51.28 U1.9 | v14.6,38.26 14.6,34.14 19.05,29.69 | 19.05,29.69 R13.1
IO34  (via drill 0.5)
  Top 0.305: v39.43,55.79 38.42,55.79 35.69,58.52 v35.69,59.54 | v30.23,56.23 29.59,55.6 29.59,53.57 23.18,47.15 17.14,47.15 15.87,45.88 v15.87,41.76
  Bottom 0.305: 14.29,40.17 12.89,41.57 12.32,41.57 XR3.E | 14.29,40.17 16.83,37.63 R15.1 | v39.43,55.79 39.43,51.38 U1.6 | v35.69,59.54 35.69,58.52 33.4,56.23 v30.23,56.23 | 14.29,40.17 v15.87,41.76
IO36  (via drill 0.5)
  Top 0.305: v35.37,54.84 35.37,55.09 v33.02,57.44 | v30.16,57.69 25.78,57.69 v23.81,55.73
  Bottom 0.305: 16.83,51.6 R17.1 | 16.83,51.6 15.24,53.19 XR4.E | v35.37,54.84 35.37,53.9 36.51,52.75 36.51,51.28 U1.4 | v33.02,57.44 32.51,57.95 30.42,57.95 v30.16,57.69 | v23.81,55.73 20.95,55.73 16.83,51.6
IO39  (via drill 0.5)
  Top 0.305: v36.89,54.65 36.89,55.16 33.02,59.03 v33.02,60.17
  Bottom 0.305: XR5.E 20.73,62.02 21.04,61.71 25.88,61.71 27.56,60.03 27.56,58.9 R19.1 31.75,58.9 v33.02,60.17 | v36.89,54.65 38.04,53.5 38.04,51.26 U1.5
IR1  (via drill 0.5)
  Top 0.305: v42.8,28.93 42.8,28.8 44.96,26.64 v46.1,26.64 | v67.31,27.79 69.21,25.88 v72.71,25.88
  Bottom 0.305: U1.30 43.04,33.6 43.04,29.17 v42.8,28.93 | v46.1,26.64 46.8,25.94 60.26,25.94 62.1,27.79 v67.31,27.79 | v72.71,25.88 72.71,21.44 75.42,18.72 75.38,16.7 IR1.3
IR2  (via drill 0.5)
  Top 0.305: v51.82,33.95 53.77,35.9 53.77,39.9 v54.99,41.12 | v59.88,41.57 60.77,42.46 60.77,46.96 68.07,54.27 68.07,63.98 69.31,65.22 72.55,65.22 76.2,68.87 76.2,73.38 IR2.3
  Bottom 0.305: v51.82,33.95 50.36,35.41 42.29,35.41 41.91,35.03 41.91,33.82 U1.31 | v54.99,41.12 59.44,41.12 v59.88,41.57
IRTX
  Bottom 0.305: RB.2 23.81,32.23 25.4,30.64 32.78,30.64 34.05,31.91 34.05,33.58 U1.37
LEDS
  Bottom 0.305: CHARGING.4-DIN 51.75,67.16 51.75,65.25 51.43,64.93 51.43,63.35 47.75,59.66 47.75,58.01 45.59,55.85 44.45,55.85 43.79,55.19 43.79,54.01 44.13,53.67 44.13,51.28 U1.10
M1A
  Bottom 0.305: 65.59,16.78 JM1.1 65.53,18.67 66.17,19.3 | 66.17,19.3 63.75,21.72 U2.3 | C9.1 68.65,19.28 68.62,19.3 66.17,19.3
M1B
  Bottom 0.305: 71.12,19.21 C9.2 | 73.34,16.99 JM1.6 73.05,18.44 71.96,19.53 C9.2 | 71.12,19.21 71.12,23.34 U2.6 | 71.12,19.21 C9.2
M2A  (via drill 0.5)
  Top 0.305: v78.42,63.98 78.42,62.97 79.37,62.01 79.37,50.65 82.55,47.47 82.55,33.82 81.6,32.87 75.56,32.87 v74.93,33.5
  Bottom 0.305: C10.1 68.9,36.04 63.82,30.96 U2.14 | v74.93,33.5 74.93,34.14 73.02,36.04 73.02,36.99 72.71,37.31 71.44,37.31 C10.1 | C10.1 | v78.42,63.98 78.42,66.84 81.79,68.86 81.79,70.14 81.07,71.22 79.83,71.22 74.33,68.11 73.05,68.11 JM2.1
M2B  (via drill 0.5)
  Top 0.305: v74.93,49.5 74.93,36.23 71.37,32.68 U2.11
  Bottom 0.305: C10.2 71.75,36.04 71.75,31.28 71.44,30.96 U2.11 | JM2.6 65.53,67.35 66.8,66.08 74.49,66.08 78.29,62.27 78.29,51.73 76.07,49.5 v74.93,49.5
N$1
  Top 0.635: CHG+.P$1 76.73,53.29 BT.+
  Bottom 0.635: BT.+ 78.74,42.39 F1.1
N$2
  Bottom 0.305: RB.1 19.91,32.23 19.91,37.72 18.1,39.53 Q4.1
N$3
  Bottom 0.635: F1.2 81.28,56.87 82.12,58.4 SW1.C
N$4
  Bottom 0.635: U4.3 71.75,60.58 | 71.75,60.58 63.51,60.58 D1.ANODE | L1.2 71.95,60.38 71.75,60.58
N$6
  Bottom 0.305: R12.2 13.65,33.5 XR2.A
N$7
  Bottom 0.305: R16.2 16.51,56.36 16.83,56.68 XR4.A
N$8  (via drill 0.5)
  Top 0.305: XR5.CATH 21.91,62.71 21.91,58.07 16.57,52.73 16.57,53.95 XR4.CATH 16.57,53.95 16.57,52.72 15.56,51.7 v15.56,48.42 | LED1\.C 90.17,37.95 87.63,35.41 87.63,29.69 83.82,23.13 | v63.82,17.31 64.57,18.06 73.79,18.06 74.22,17.63 80.47,17.63 83.82,23.13 | v60.96,18.9 56.83,18.9 52.39,14.45 45.72,14.45 40.64,19.53 v26.99,19.53 | Q4.2 18.03,43.09 16.51,44.61 16.51,45.57 17.46,46.52 20.95,46.52 26.24,41.23 26.24,36.67 32.84,30.07 50.74,30.07 52.07,28.74 52.07,24.29 v54.61,21.75 | 83.82,23.13 82.36,20.61
  Bottom 0.305: 15.56,43.14 17.39,43.14 18.01,42.52 18.01,42.41 Q4.2 | 15.56,43.14 XR3.CATH | v15.56,48.42 15.56,43.14 | XR2.CATH 14.92,31.28 14.6,30.96 14.6,28.74 16.51,26.83 17.14,26.83 20.64,23.34 20.64,22.71 XR1.CATH 20.7,22.65 20.7,21.69 22.86,19.53 v26.99,19.53 | v63.82,17.31 62.55,17.31 v60.96,18.9 59.37,20.48 55.88,20.48 v54.61,21.75
N$9  (via drill 0.5)
  Top 0.305: v51.75,15.72 48.67,15.72 46.35,18.03 46.35,19.53 47.31,20.48 50.16,20.48 50.8,19.85 55.88,19.85 57.47,21.44 57.47,22.07 53.85,25.69 53.85,29.06 56.13,31.34 56.13,42.07 v55.5,42.71 | v59.05,42.77 59.05,48.11 50.16,57 50.16,60.17 43.98,66.35 v43.98,70.43
  Bottom 0.305: v51.75,15.72 51.75,14.13 STATE.4-DIN | v55.5,42.71 58.99,42.71 v59.05,42.77 | v43.98,70.43 44.24,70.69 47.04,70.69 CHARGING.2-DOUT
N$10
  Bottom 0.305: XR3.A 11.11,44.46 11.11,38.9 12.38,37.63 R14.2
N$11
  Bottom 0.305: R18.2 18.73,65.25 23.18,65.25 24.13,64.3 XR5.A
N$12
  Bottom 0.305: Q1.1 74.61,41.76 74.61,41.12 R4.2
N$13
  Bottom 0.305: R10.2 18.73,23.66 XR1.A
N$14
  Bottom 0.305: LED1\.A 89.85,43.66 R20.1
N$15
  Bottom 0.305: Q2.1 70.48,41.76 70.48,38.58 R5.2
RTS  (via drill 0.5)
  Top 0.305: v77.47,26.83 75.69,26.83 v74.99,27.53
  Bottom 0.305: 72.71,39.22 72.71,41.76 Q1.2 | 72.71,39.22 R5.1 72.71,39.22 | 72.71,39.22 74.61,37.31 77.79,37.31 78.74,36.36 78.74,34.45 77.15,32.87 76.2,32.87 75.12,31.79 75.12,27.66 v74.99,27.53 | v77.47,26.83 79.15,25.16 79.15,21.44 81.36,20.17 82.73,20.75 PROGRAMMER.3
RXD  (via drill 0.5)
  Top 0.305: v64.07,26.52 65.34,26.52 67.44,24.42 67.44,21.37 68.96,19.85 76.2,19.85 80.01,23.66 80.01,30.64 80.96,31.6 82.55,31.6 83.82,30.33 83.82,28.93 PROGRAMMER.10
  Bottom 0.305: v64.07,26.52 62.29,26.52 61.02,25.25 51.56,25.25 49.21,22.9 45.15,22.9 41.57,26.47 39.04,26.5 38.1,25.56 32.7,25.56 29.78,22.64 25.15,22.64 24.19,23.6 24.19,24.74 25.02,25.56 29.15,25.56 30.72,27.14 32.75,27.14 36.65,31.04 U1.35
SCL
  Bottom 0.305: U1.36 35.45,33.58 35.45,31.61 31.91,28.08 30,28.08 28.75,26.83 26.67,26.83 I2C.3
SDA
  Bottom 0.305: U1.33 39.05,33.5 39.05,30.64 37.78,29.37 37.78,27.34 36.64,26.2 31.11,26.2 29.21,24.29 26.67,24.29 I2C.4
TOUCH1  (via drill 0.5)
  Top 0.305: v58.48,37.63 58.48,34.96 v57.97,34.45 | v50.93,27.09 49.53,27.09 46.42,23.98 40,23.98 v39.05,24.93 | v22.22,25.25 22.22,27.79 11.11,38.9 11.11,49.38 12.06,50.33 12.06,57.99 22.23,68.16 T1.P$2
  Bottom 0.305: v57.97,34.45 57.97,34.14 v50.93,27.09 | v39.05,24.93 33.02,24.93 30.1,22.01 24.45,22.01 22.22,24.23 v22.22,25.25 | U1.24 55.37,36.68 56.39,37.69 58.42,37.69 v58.48,37.63
TOUCH2  (via drill 0.5)
  Top 0.305: v47.94,27.15 47.94,26.9 46.29,25.25 v40.96,25.25 | v24.13,18.26 24.13,12.55 22.54,10.96 T2.P$2
  Bottom 0.305: v47.94,27.15 47.94,33.5 U1.26 | v40.96,25.25 33.97,18.26 v24.13,18.26
TXD  (via drill 0.5)
  Top 0.305: v36.64,27.79 36.64,25.75 41.27,21.12 50.48,21.12 51.12,20.48 54.93,20.48 v56.2,21.75
  Bottom 0.305: v36.64,27.79 36.64,29.54 37.92,30.84 U1.34 | v56.2,21.75 56.51,21.44 61.98,21.44 62.55,22.01 62.55,24.55 63.25,25.25 69.98,25.25 72.14,27.41 73.02,27.41 74.1,26.33 75.37,26.33 77.66,28.61 79.5,28.61 PROGRAMMER.8
VCC  (via drill 0.5)
  Top 0.305: v48.58,64.08 48.58,62.71 55.56,55.73 55.56,53.19 v56.83,51.92 | v81.28,30.33 81.28,21.75 PROGRAMMER.4 | v81.28,34.14 81.28,38.26 79.37,40.17 v79.37,49.06
  Bottom 0.305: C1.1 66.67,41.12 67.18,41.63 67.18,44.68 66.04,45.82 66.04,47.6 65.15,48.49 65.15,49.23 U3.1 | 68.26,53.82 L1.1 67.94,53.19 67.31,53.19 | v48.58,64.08 46.77,64.08 R2.2 | 66.99,51.92 v56.83,51.92 | v81.28,34.14 v81.28,30.33 | 78.39,50.04 v79.37,49.06
  Bottom 0.635: SW1.A 80.01,62.71 79.25,61.57 79.25,50.9 78.39,50.04 76.45,48.11 68.88,48.11 68.07,48.91 67.37,48.91 U3.3 66.99,50.33 | L1.1 67.77,53.84 | C3.1 68.26,53.82 68.26,53.5 67.94,53.19 | U3.1 65.09,50.33 65.4,50.65 66.67,50.65 66.99,50.33 | 66.99,50.33 66.99,51.92 66.99,52.87 67.31,53.19
(copper drawn outside any net)
  shapes: Top circle x4

### Text on the board
tPlace: M1 GND C1 C2 VCC M2 | 3V3 GND D0 | ON | +5V GND | - | RESET | + | OFF | SDA SCL GND +3V3 | GND | GND | SWARMESH 2020 / 2020/07/10 / v1.0.3 | DTR | RTS | M1 GND C1 C2 VCC M2 | +3V3 GND D0
bPlace: POWER | - | +
tNames: IR2